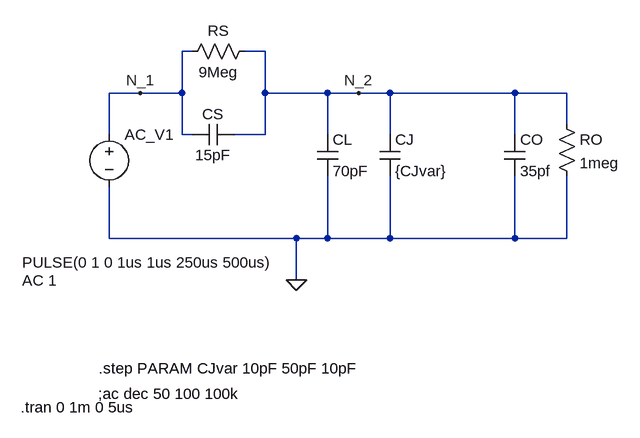
[diagram p0: schematic lab1_prep_3-1_schematic.asc]
lab1_prep_3-1_schematic.asc, the LTspice schematic file:
Version 4
SHEET 1 880 680
WIRE -32 0 -48 0
WIRE 80 0 48 0
WIRE -112 64 -160 64
WIRE -48 64 -48 0
WIRE -48 64 -112 64
WIRE 80 64 80 0
WIRE 176 64 80 64
WIRE 224 64 176 64
WIRE 272 64 224 64
WIRE 464 64 272 64
WIRE 544 64 464 64
WIRE 544 112 544 64
WIRE -160 128 -160 64
WIRE -48 128 -48 64
WIRE -32 128 -48 128
WIRE 80 128 80 64
WIRE 80 128 32 128
WIRE 176 128 176 64
WIRE 272 128 272 64
WIRE 464 128 464 64
WIRE -160 288 -160 208
WIRE 128 288 -160 288
WIRE 176 288 176 192
WIRE 176 288 128 288
WIRE 272 288 272 192
WIRE 272 288 176 288
WIRE 464 288 464 192
WIRE 464 288 272 288
WIRE 544 288 544 192
WIRE 544 288 464 288
WIRE 128 352 128 288
FLAG 128 352 0
FLAG -112 64 N_1
FLAG 224 64 N_2
SYMBOL res 528 96 R0
SYMATTR InstName RO
SYMATTR Value 1meg
SYMBOL res -48 16 R270
WINDOW 0 32 56 VTop 0
WINDOW 3 0 56 VBottom 0
SYMATTR InstName RS
SYMATTR Value 9Meg
SYMBOL cap 160 128 R0
SYMATTR InstName CL
SYMATTR Value 70pF
SYMBOL cap 256 128 R0
SYMATTR InstName CJ
SYMATTR Value {CJvar}
SYMBOL cap -32 144 R270
WINDOW 0 32 32 VTop 0
WINDOW 3 0 32 VBottom 0
SYMATTR InstName CS
SYMATTR Value 15pF
SYMBOL cap 448 128 R0
SYMATTR InstName CO
SYMATTR Value 35pf
SYMBOL voltage -160 112 R0
WINDOW 3 -134 213 Left 0
WINDOW 123 -134 241 Left 0
WINDOW 39 0 0 Left 0
SYMATTR InstName AC_V1
SYMATTR Value PULSE(0 1 0 1us 1us 250us 500us)
SYMATTR Value2 AC 1
TEXT -176 488 Left 0 !.step PARAM CJvar 10pF 50pF 10pF
TEXT -177 527 Left 0 !;ac dec 50 100 100k
TEXT -296 548 Left 0 !.tran 0 1m 0 5us

The netlist it stands for:
* lab1_prep_3-1_schematic.asc
RO N_2 0 1meg
RS N_1 N_2 9Meg
CL N_2 0 70pF
CJ N_2 0 {CJvar}
CS N_1 N_2 15pF
CO N_2 0 35pf
V§AC_V1 N_1 0 PULSE(0 1 0 1us 1us 250us 500us) AC 1
.step PARAM CJvar 10pF 50pF 10pF
;ac dec 50 100 100k
.tran 0 1m 0 5us
.backanno
.end